# Altium schematic sheet 04_Sch.SchDoc
size A3
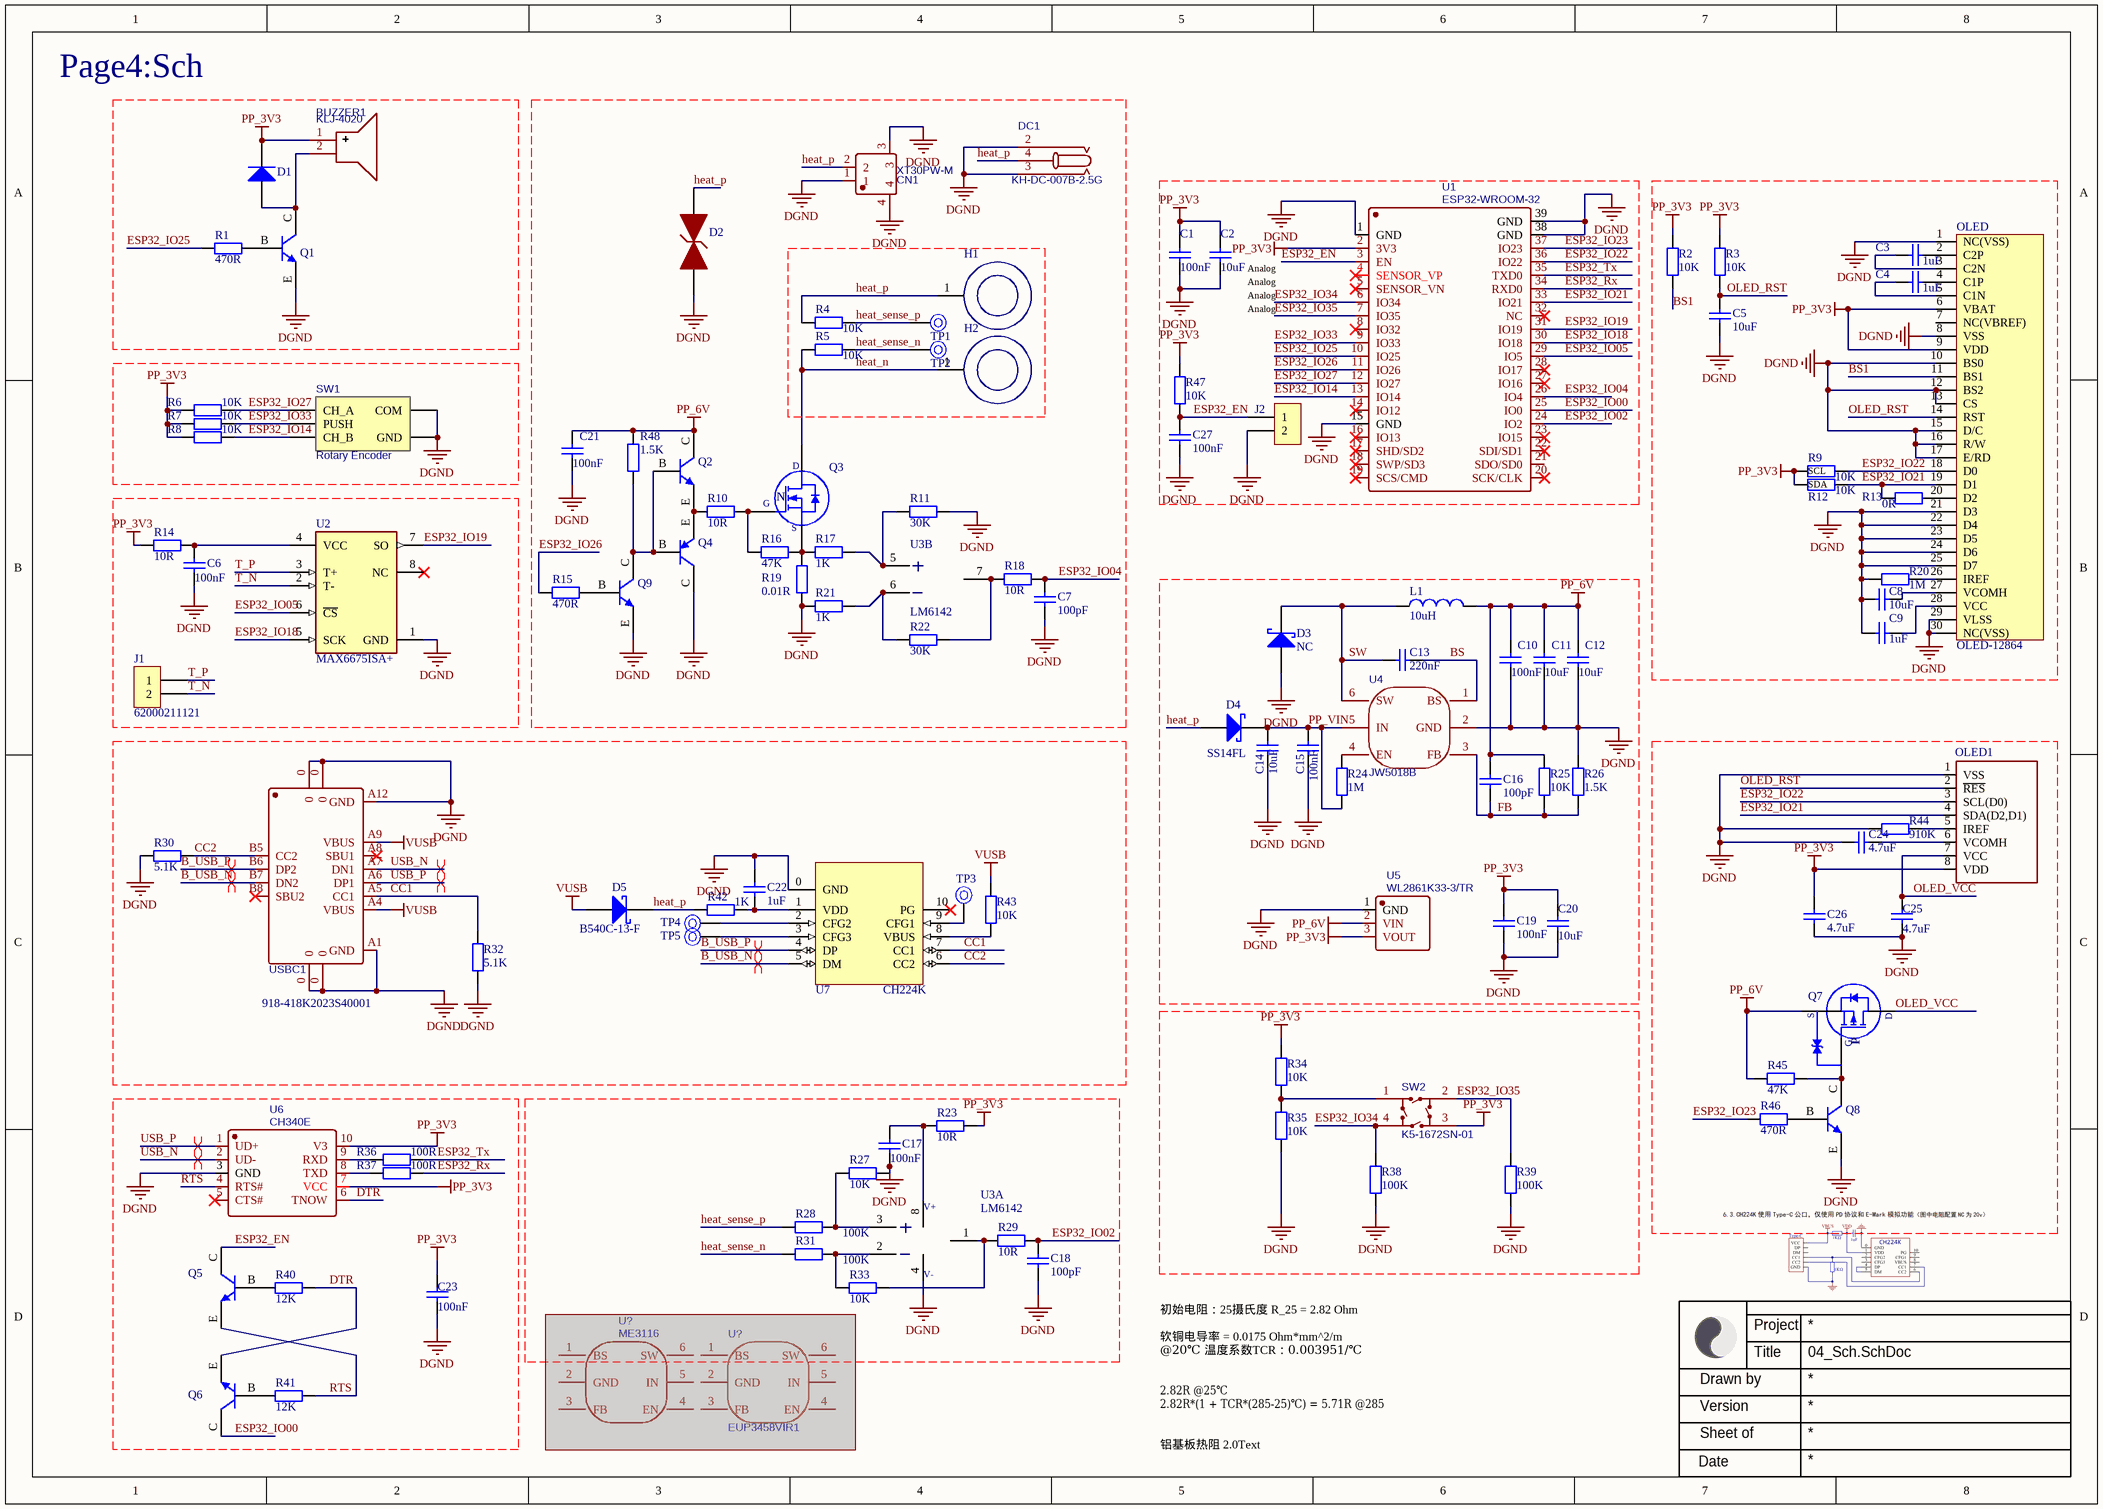
[diagram p0: 04_Sch.SchDoc]

## Parts
(Parts that share a designator on the sheet are numbered #1, #2 ... from top to bottom, then left to right.)
BUZZER1  KLJ-4020  [BUZ-SMD_L4.0-W4.0-P3.50-L]
C1  100nF  [C0603]
C2  10uF  [C0805]
C3  1uF  [C0603]
C4  1uF  [C0603]
C5  10uF  [C0603]
C6  100nF  [C0603]
C7  100pF  [C0603]
C8  10uF  [C0603]
C9  1uF  [C0603]
C10  100nF  [C0603]
C11  10uF  [C1210]
C12  10uF  [C1210]
C13  220nF  [C0603]
C14  10uF  [C1210]
C15  100nF  [C0603]
C16  100pF  [C0603]
C17  100nF  [C0603]
C18  100pF  [C0603]
C19  100nF  [C0603]
C20  10uF  [C0805]
C21  100nF  [C0603]
C22  1uF  [C0603]
C23  100nF  [C0603]
C24  4.7uF  [C0603]
C25  4.7uF  [C0603]
C26  4.7uF  [C0603]
C27  100nF  [C0603]
CN1  XT30PW-M  [CONN-TH_XT30PW-M]
D1  1N4148WT-7  [SOD-523]  (value not drawn)
D2  SMBJ33CA  [SMBJ-CA_MFG]  (value not drawn)
D3  NC  [SOD-123FL]
D4  SS14FL  [SOD-123FL]
D5  B540C-13-F  [SMC]
DC1  KH-DC-007B-2.5G  [DC-IN-TH_KH-DC-007B-2.1G]
H1  (no value)  [THC3R5D1R6-M1R6-PTH]
H2  (no value)  [THC3R5D1R6-M1R6-PTH]
J1  62000211121  [CON2P-2R0-TH]
J2  62000211121  [CON2P-2R0-TH]  (value not drawn)
L1  10uH  [IND4R45X4R06X1-2]
OLED  OLED-12864  [OLED-12864-1.3-TOP]
OLED1  OLED12864_8Pin  [OLED_0.69_8Pin]  (value not drawn)
Q1  MMBT2222ALT1G  [SOT-23-BCE]  (value not drawn)
Q2  MMBT2222ALT1G  [SOT-23-BCE]  (value not drawn)
Q3  (no value)  [D2PAK-3-GDS]
Q4  MMBT4403  [SOT-23-BCE]  (value not drawn)
Q5  MMBT2222ALT1G  [SOT-23-BCE]  (value not drawn)
Q6  MMBT2222ALT1G  [SOT-23-BCE]  (value not drawn)
Q7  CPH3355-TL-W  [SOT-23-GDS]  (value not drawn)
Q8  MMBT2222ALT1G  [SOT-23-BCE]  (value not drawn)
Q9  MMBT2222ALT1G  [SOT-23-BCE]  (value not drawn)
R1  470R  [R0603]
R2  10K  [R0603]
R3  10K  [R0603]
R4  10K  [R0603]
R5  10K  [R0603]
R6  10K  [R0603]
R7  10K  [R0603]
R8  10K  [R0603]
R9  10K  [R0603]
R10  10R  [R0603]
R11  30K  [R0603]
R12  10K  [R0603]
R13  0R  [R0603]
R14  10R  [R0603]
R15  470R  [R0603]
R16  47K  [R0603]
R17  1K  [R0603]
R18  10R  [R0603]
R19  0.01R  [R2512]
R20  1M  [R0603]
R21  1K  [R0603]
R22  30K  [R0603]
R23  10R  [R0603]
R24  1M  [R0603]
R25  10K  [R0603]
R26  1.5K  [R0603]
R27  10K  [R0603]
R28  100K  [R0603]
R29  10R  [R0603]
R30  5.1K  [R0603]
R31  100K  [R0603]
R32  5.1K  [R0603]
R33  10K  [R0603]
R34  10K  [R0603]
R35  10K  [R0603]
R36  100R  [R0603]
R37  100R  [R0603]
R38  100K  [R0603]
R39  100K  [R0603]
R40  12K  [R0603]
R41  12K  [R0603]
R42  1K  [R0603]
R43  10K  [R0603]
R44  910K  [R0603]
R45  47K  [R0603]
R46  470R  [R0603]
R47  10K  [R0603]
R48  1.5K  [R0603]
SW1  Rotary Encoder  [SIQ-02FVS3]
SW2  K5-1672SN-01  [SW-SMD_K5-1672SN-01]
TP1  5001  [TP-2R54-TH]  (value not drawn)
TP2  5001  [TP-2R54-TH]  (value not drawn)
TP3  (no value)  [TP-0R5-SM]
TP4  (no value)  [TP-0R5-SM]
TP5  (no value)  [TP-0R5-SM]
U1  ESP32-WROOM-32  [WIFIM-SMD_ESP-32S]
U2  Part Number: MAX6675ISA+  [SOIC8-1R27-5X4]  (hidden comment: MAX6675ISA)
U3  LM6142  [SOIC8-1R27-5X4]  (parts A,B of 2)
U4  JW5018B  [SOT-23-6_L2.9-W1.6-P0.95-LS2.8-BR]
U5  WL2861K33-3/TR  [SOT-89-3_L4.5-W2.5-P1.50-LS4.2-BR]
U6  CH340E  [MSOP-10_L3.0-W3.0-P0.50-LS5.0-BL]
U7  CH224K  [ESSOP10]
U?#1  ME3116  [SOT-23-6_L2.9-W1.6-P0.95-LS2.8-BR]  (masked out: inside a compile mask, not in the netlist)
U?#2  EUP3458VIR1  [SOT-23-6_L2.9-W1.6-P0.95-LS2.8-BR]  (masked out: inside a compile mask, not in the netlist)
USBC1  value 918-418K2023S40001  [USB-C-SMD_TYPE-C-USB-17]  (hidden comment: USB3.1C16PFSMT)

## Nets
DGND: C1.2 C2.2 C5.1 C6.2 C7.2 C8.1 C9.1 C10.2 C11.2 C12.2 C14.2 C15.2 C17.2 C18.2 C19.2 C20.2 C21.2 C22.2 C23.2 C24.1 C25.1 C26.1 C27.2 CN1.1 CN1.3 CN1.4 D2.1 D3.1 DC1.2 DC1.3 J2.2 OLED.1(NC(VSS)) OLED.8(VSS) OLED.10(BS0) OLED.12(BS2) OLED.13(CS) OLED.15(D/C) OLED.16(R/W) OLED.17(E/RD) OLED.21(D3) OLED.22(D4) OLED.23(D5) OLED.24(D6) OLED.25(D7) OLED.29(VLSS) OLED.30(NC(VSS)) OLED1.1(VSS) Q1.E Q4.C Q8.E Q9.E R11.2 R19.1 R20.1 R21.1 R26.2 R27.2 R30.2 R32.1 R35.1 R38.1 R39.1 R44.1 SW1.3(COM) SW1.5(GND) U1.1(GND) U1.15(GND) U1.38(GND) U1.39(GND) U2.1(GND) U3.4(V-) U4.2(GND) U5.1(GND) U6.3(GND) U7.0(GND) USBC1.0 USBC1.A1(GND) USBC1.A12(GND)
PP_3V3: BUZZER1.1(+) C1.1 C2.1 C19.1 C20.1 C23.1 C26.2 D1.2 OLED.6(VBAT) OLED.9(VDD) OLED1.8(VDD) R2.1 R3.2 R6.1 R7.1 R8.1 R9.1 R12.1 R14.1 R23.1 R34.2 R47.1 SW2.3 U1.2(3V3) U5.3(VOUT) U6.7(VCC) U6.10(V3)
PP_6V: C10.1 C11.1 C12.1 C16.1 C21.1 L1.1 Q2.C Q7.S R25.2 R45.1 R48.2 U5.2(VIN)
VUSB: D5.1 R43.2 USBC1.A4(VBUS) USBC1.A9(VBUS)
B_USB_N: U7.5(DM) USBC1.B7(DN2)
B_USB_P: U7.4(DP) USBC1.B6(DP2)
BS: C13.1 U4.1(BS)
BS1: OLED.11(BS1) R2.2
CC1: R32.2 U7.7(CC1) USBC1.A5(CC1)
CC2: R30.1 U7.6(CC2) USBC1.B5(CC2)
DTR: Q6.E R40.2 U6.6(TNOW)
ESP32_EN: C27.1 J2.1 Q5.C R47.2 U1.3(EN)
ESP32_IO00: Q6.C U1.25(IO0)
ESP32_IO02: C18.1 R29.2 U1.24(IO2)
ESP32_IO04: C7.1 R18.2 U1.26(IO4)
ESP32_IO05: U1.29(IO5) U2.6(~{CS})
ESP32_IO14: R8.2 SW1.4(CH_B) U1.13(IO14)
ESP32_IO18: U1.30(IO18) U2.5(SCK)
ESP32_IO19: U1.31(IO19) U2.7(SO)
ESP32_IO21: OLED.19(D1) OLED1.4(SDA(D2,D1)) R12.2 R13.1 U1.33(IO21)
ESP32_IO22: OLED.18(D0) OLED1.3(SCL(D0)) R9.2 U1.36(IO22)
ESP32_IO23: R46.1 U1.37(IO23)
ESP32_IO25: R1.1 U1.10(IO25)
ESP32_IO26: R15.1 U1.11(IO26)
ESP32_IO27: R6.2 SW1.1(CH_A) U1.12(IO27)
ESP32_IO33: R7.2 SW1.2(PUSH) U1.9(IO33)
ESP32_IO34: R38.2 SW2.4 U1.6(IO34)
ESP32_IO35: R39.2 SW2.2 U1.7(IO35)
ESP32_Rx: R37.2 U1.34(RXD0)
ESP32_Tx: R36.2 U1.35(TXD0)
FB: C16.2 R25.1 R26.1 U4.3(FB)
heat_n: H2.1 Q3.D R5.1
heat_p: CN1.2 D2.2 D4.1 D5.2 DC1.4 H1.1 R4.1 R42.1
heat_sense_n: R5.2 R31.1 TP2.1
heat_sense_p: R4.2 R28.1 TP1.1
OLED_RST: C5.2 OLED.14(RST) OLED1.2(~{RES}) R3.1
OLED_VCC: C25.2 OLED1.7(VCC) Q7.D
PP_VIN: C14.1 C15.1 D4.2 R24.1 U4.5(IN)
RTS: Q5.E R41.2 U6.4(RTS#)
SW: C13.2 D3.2 L1.2 U4.6(SW)
T_N: J1.2 U2.2(T-)
T_P: J1.1 U2.3(T+)
USB_N: U6.2(UD-) USBC1.A7(DN1)
USB_P: U6.1(UD+) USBC1.A6(DP1)
NetBUZZER1_2: BUZZER1.2(-) D1.1 Q1.C
NetC3_1: C3.1 OLED.3(C2N)
NetC3_2: C3.2 OLED.2(C2P)
NetC4_1: C4.1 OLED.5(C1N)
NetC4_2: C4.2 OLED.4(C1P)
NetC6_1: C6.1 R14.2 U2.4(VCC)
NetC8_2: C8.2 OLED.27(VCOMH)
NetC9_2: C9.2 OLED.28(VCC)
NetC17_1: C17.1 R23.2 U3.8(V+)
NetC22_1: C22.1 R42.2 U7.1(VDD)
NetC24_2: C24.2 OLED1.6(VCOMH)
NetOLED1_5: OLED1.5(IREF) R44.2
NetOLED_20: OLED.20(D2) R13.2
NetOLED_26: OLED.26(IREF) R20.2
NetQ1_B: Q1.B R1.2
NetQ2_B: Q2.B Q4.B Q9.C R48.1
NetQ2_E: Q2.E Q4.E R10.1
NetQ3_G: Q3.G R10.2 R16.1
NetQ3_S: Q3.S R16.2 R17.1 R19.2
NetQ5_B: Q5.B R40.1
NetQ6_B: Q6.B R41.1
NetQ7_G: Q7.G Q8.C R45.2
NetQ8_B: Q8.B R46.2
NetQ9_B: Q9.B R15.2
NetR11_1: R11.1 R17.2 U3.5(+INB)
NetR18_1: R18.1 R22.2 U3.7(OUT_B)
NetR21_2: R21.2 R22.1 U3.6(-IN_B)
NetR24_2: R24.2 U4.4(EN)
NetR27_1: R27.1 R28.2 U3.3(+IN_A)
NetR29_1: R29.1 R33.2 U3.1(OUT_A)
NetR31_2: R31.2 R33.1 U3.2(-IN_A)
NetR34_1: R34.1 R35.2 SW2.1
NetR36_1: R36.1 U6.9(RXD)
NetR37_1: R37.1 U6.8(TXD)
NetR43_1: R43.1 U7.8(VBUS)
NetTP3_1: TP3.1 U7.9(CFG1)
NetTP4_1: TP4.1 U7.2(CFG2)
NetTP5_1: TP5.1 U7.3(CFG3)

Not connected (* = marked no-connect by the designer): OLED 7(NC(VBREF)); U1 4(SENSOR_VP)* 5(SENSOR_VN)* 8(IO32)* 14(IO12)* 16(IO13)* 17(SHD/SD2)* 18(SWP/SD3)* 19(SCS/CMD)* 20(SCK/CLK)* 21(SDO/SD0) 22(SDI/SD1)* 23(IO15)* 27(IO16)* 28(IO17)* 32(NC)*; U2 8(NC)*; U6 5(CTS#)*; U7 10(PG)*; USBC1 A8(SBU1)* B8(SBU2)*

## Layout directives
differential pair: B_USB_N, B_USB_P, USB_N, USB_P

## Notes on the sheet
- Page4:Sch
- (near C2) Analog
- Analog
- (near R12) SDA
- (near R9) SCL
- 初始电阻：25摄氏度 R_25 = 2.82 Ohm
  软铜电导率 = 0.0175 Ohm*mm^2/m @20℃ 温度系数TCR：0.003951/℃
  2.82R @25℃
  2.82R*(1 + TCR*(285-25)℃) = 5.71R @285
  铝基板热阻 2.0Text
- Drawn by
- Project
- Title
- Version
- Sheet of
- Date
- (in symbol 101MN-00036AM.01) N

## Library data of the parts
BUZZER1 = KLJ-4020: BOM_Manufacturer: KELIKING; Contributor: LCSC; Frequency: 4kHz; BOM_Supplier: LCSC; BOM_Supplier Part: C556936; BOM_Manufacturer Part: KLJ-4020; BOM_JLCPCB Part Class: Extended Part; spicePre: B; spiceSymbolName: KLJ-4020
C1 C6 C10 C15 C17 C19 C21 C23 C27 = 101CC-00003IA.01: SMD,电容量100nF,额定电压50V,偏差±10%,材质X7R,0603; Allow Altenative Part: Y; serial number: 194; Categories: 电容; Tolerance: ±10%; Rated Voltage: 50V; Temperature Coefficient: X7R; COMPONENTLINK 1 DESCRIPTION: OpenDatasheet; Modify time: 2018年10月27号; Preferred: P; Part Number: 101CC-00003IA.01; Category: 贴片电容; Value: 100nF; PACKAGE: Tape&Reel; Mounting Type: SurfaceMount; Size: 0603; Supplier 1: 运泰利; Supplier Part Number 1: 100nF,0603,50V
C2 C20 = 101CC-00453BW.01: SMD,电容量10uF,额定电压10V,偏差±10%,材质X7R,0805; Allow Altenative Part: Y; serial number: 52; Categories: 电容; Tolerance: ±10%; Rated Voltage: 10V; Temperature Coefficient: X7R; COMPONENTLINK 1 DESCRIPTION: GetDatasheet; Remark: Verified by BU1（黄雄青） check list V1.0; Modify time: 2016年05月12号; Approved: YES; Part Number: 101CC-00453BW.01; Category: 贴片电容; Value: 10uF; PACKAGE: Tape&Reel; Mounting Type: SurfaceMount; Size: 0805; Supplier 1: YAGEO; Supplier Part Number 1: CC0805KKX7R6BB106; Pricing 1: 0.423; COMPONENTLINK 1 URL: http://www.yageo.com/documents/recent/UPY-GPHC_X7R_6.3V-to-50V_13.pdf; MOQ: 3000
C3 C4 C9 C22 = 101CC-00005IA.01: SMD,电容量1uF,额定电压50V,偏差±10%,材质X5R,0603; Allow Altenative Part: Y; serial number: 196; Categories: 电容; Tolerance: ±10%; Rated Voltage: 50V; Temperature Coefficient: X5R; COMPONENTLINK 1 DESCRIPTION: OpenDatasheet; Modify time: 2018年10月27号; Preferred: P; Part Number: 101CC-00005IA.01; Category: 贴片电容; Value: 1uF; PACKAGE: Tape&Reel; Mounting Type: SurfaceMount; Size: 0603; Supplier 1: 运泰利; Supplier Part Number 1: 1uF,0603,50V
C5 C8 = 101CC-00006IA.01: SMD,电容量10uF,额定电压25V,偏差±20%,材质X5R,0603; Allow Altenative Part: Y; serial number: 197; Categories: 电容; Tolerance: ±20%; Rated Voltage: 25V; Temperature Coefficient: X5R; COMPONENTLINK 1 DESCRIPTION: OpenDatasheet; Modify time: 2018年10月27号; Preferred: P; Part Number: 101CC-00006IA.01; Category: 贴片电容; Value: 10uF; PACKAGE: Tape&Reel; Mounting Type: SurfaceMount; Size: 0603; Supplier 1: 运泰利; Supplier Part Number 1: 10uF,0603,25V
C7 C16 C18 = 101CC-00004IA.01: SMD,电容量100pF,额定电压50V,偏差±5%,材质NP0,0603; Allow Altenative Part: Y; serial number: 195; Categories: 电容; Tolerance: ±5%; Rated Voltage: 50V; Temperature Coefficient: NP0; COMPONENTLINK 1 DESCRIPTION: OpenDatasheet; Modify time: 2018年10月27号; Preferred: P; Part Number: 101CC-00004IA.01; Category: 贴片电容; Value: 100pF; PACKAGE: Tape&Reel; Mounting Type: SurfaceMount; Size: 0603; Supplier 1: 运泰利; Supplier Part Number 1: 100pF,0603,50V
C11 C12 C14 = 101CC-00555BW.01: SMD,电容量10uF,额定电压50V,偏差±10%,材质X7R,1210; Allow Altenative Part: Y; serial number: 176; Categories: 电容; Tolerance: ±10%; Rated Voltage: 50V; Temperature Coefficient: X7R; COMPONENTLINK 1 DESCRIPTION: OpenDatasheet; Modify time: 2018年5月26号; Part Number: 101CC-00555BW.01; Category: 贴片电容; Value: 10uF; PACKAGE: Tape&Reel; Mounting Type: SurfaceMount; Size: 1210; Supplier 1: YAGEO; Supplier Part Number 1: CC1210KKX7R9BB106; COMPONENTLINK 1 URL: http://www.yageo.com/documents/recent/UPY-GPHC_X7R_6.3V-to-50V_18.pdf
C13 = 101CC-00490BW.01: SMD,电容量220nF,额定电压50V,精度±10%,材质X7R,0603; Allow Altenative Part: Y; serial number: 80; Categories: 电容; Tolerance: ±10%; Rated Voltage: 50V; Temperature Coefficient: X7R; COMPONENTLINK 1 DESCRIPTION: GetDatasheet; Remark: Verified by BU1（黄雄青） check list V1.0; Modify time: 2017年01月07号; Approved: YES; Part Number: 101CC-00490BW.01; Category: 贴片电容; Value: 220nF; PACKAGE: Tape&Reel; Mounting Type: SurfaceMount; Size: 0603; Supplier 1: YAGEO; Supplier Part Number 1: CC0603KRX7R9BB224
C24-C26 = 101CC-00390AV.01: 安装方式SMD,电容量4.7uF,额定电压25V,偏差±10%,材质X5R,0603; Allow Altenative Part: Y; serial number: 587; Categories: 电容; Tolerance: ±10%; Rated Voltage: 25V; Temperature Coefficient: X5R; COMPONENTLINK 1 DESCRIPTION: GetDatasheet; Modify time: 2019年9月14号; Part Number: 101CC-00390AV.01; Category: 贴片电容; Value: 4.7uF; PACKAGE: Tape&Reel; Mounting Type: SurfaceMount; Size: 0603; Supplier 1: Murata; Supplier Part Number 1: GRM188R61E475KE11D; COMPONENTLINK 1 URL: https://www.murata.com/~/media/webrenewal/support/library/catalog/products/capacitor/mlcc/c02e.ashx?la=en-us
CN1 = XT30PW-M: BOM_Manufacturer: Changzhou Amass Elec; Contributor: LCSC; BOM_Supplier: LCSC; BOM_Supplier Part: C431092; BOM_Manufacturer Part: XT30PW-M; BOM_JLCPCB Part Class: Extended Part; spicePre: C; spiceSymbolName: XT30PW-M
D1 = 101DG-00019AF.01: SMD,SOD-523（0603）,额定电压80V,电流125mA; Allow Altenative Part: Y; serial number: 48; Categories: 二极管; Rated Voltage: 80V; Rated Current: 250mA; COMPONENTLINK 1 DESCRIPTION: GetDatasheet; Remark: Verified by CRD（张宗良） check list V1.0; Modify time: 2015年07月28号; Approved: YES; Preferred: P; Part Number: 101DG-00019AF.01; Category: 普通二极管; Value: 1N4148WT-7; PACKAGE: Tape&Reel; Mounting Type: SurfaceMount; Supplier 1: DIODES; Supplier Part Number 1: 1N4148WT-7; Pricing 1: 0.36; COMPONENTLINK 1 URL: http://www.diodes.com/datasheets/ds30396.pdf; MOQ: 1000
D2 = SMBJ28CA
D3 D4 = 101DS-00017AI.01: SMD,封装外壳SOD-123-2,额定电压40V,电流1A; Allow Altenative Part: Y; serial number: 98; Categories: 二极管; Rated Voltage: 40V; Rated Current: 1A; COMPONENTLINK 1 DESCRIPTION: GetDatasheet; Remark: Verified by CRD（李思奇） check list V3.0; Modify time: 2017年03月20号; Approved: YES; Part Number: 101DS-00017AI.01; Category: 肖特基二极管; PACKAGE: Tape&Reel; Mounting Type: SurfaceMount; Supplier 1: Fairchild; Pricing 1: 1.28; COMPONENTLINK 1 URL: https://www.fairchildsemi.com/datasheets/SS/SS13FL.pdf
  D3: Value: NC; Supplier Part Number 1: NC
  D4: Value: SS14FL; Supplier Part Number 1: SS14FL
D5 = 101DS-00045AF.01: SMD,封装外壳SMC（DO-214AB）,额定电压40V,电流5A; Allow Altenative Part: Y; serial number: 86; Categories: 二极管; Rated Voltage: 40V; Rated Current: 5A; COMPONENTLINK 1 DESCRIPTION: GetDatasheet; Remark: Verified by CRD（张宗良） check list V1.0; Modify time: 2017年01月23号; Approved: YES; Preferred: P; Part Number: 101DS-00045AF.01; Category: 肖特基二极管; Value: B540C-13-F; PACKAGE: Tape&Reel; Mounting Type: SurfaceMount; Supplier 1: DIODES; Supplier Part Number 1: B540C-13-F; Pricing 1: 1.4; COMPONENTLINK 1 URL: https://www.diodes.com/assets/Datasheets/ds13012.pdf; MOQ: 3000
DC1 = KH-DC-007B-2.5G: BOM_Manufacturer: kinghelm(金航标); Contributor: LCSC; BOM_Supplier: LCSC; BOM_Supplier Part: C2847176; BOM_Manufacturer Part: KH-DC-007B-2.5G; BOM_JLCPCB Part Class: Extended Part; spicePre: D; spiceSymbolName: KH-DC-007B-2.5G
H1 H2 = M1.6-PTH: Allow Altenative Part: Y; serial number: 9; Categories: 符号; Modify time: 2017年2月13日; Approved: YES; Part Number: M1.6-PTH; Category: SCREW; Supplier 1: CRD
J1 J2 = 102NL-00015BV.01: DIP,封装脚距2mm,180度,1x2PIN,黑色; Allow Altenative Part: Y; serial number: 70; Categories: 连接器; COMPONENTLINK 1 DESCRIPTION: GetDatasheet; Remark: Verified by CRD（赖程奇） check list V1.0; Modify time: 2015年07月10号; Approved: YES; Part Number: 102NL-00015BV.01; Category: 单排针; Value: 62000211121; PACKAGE: Bulk; Mounting Type: ThroughHole; Supplier 1: wurth; Supplier Part Number 1: 62000211121; Pricing 1: 0.98; COMPONENTLINK 1 URL: http://katalog.we-online.de/en/em/620_0xx_111_21/620_032_111_21?m=n&sp=http%3A%2F%2Fwww.we-online.com%2Fweb%2Fen%2Fwuerth_elektronik%2Fsearchpage.php%3Fsearch%3D62003211121; MOQ: 500
L1 = 101LP-00508BV.01: 安装方式SMD,电感值10uH,精度±20%,额定电流1.5A,屏蔽式,4.45x4.06x1.8mm; Allow Altenative Part: Y; serial number: 194; Categories: 电感; Tolerance: ±20%; Rated Current: 1.5A; COMPONENTLINK 1 DESCRIPTION: OpenDatasheet; Modify time: 2019年8月10号; Part Number: 101LP-00508BV.01; Category: 功率电感; Value: 10uH; PACKAGE: Tape&Reel; Mounting Type: SurfaceMount; Size: 4.45x4.06x1.8mm; Supplier 1: Wurth; Supplier Part Number 1: 74437324100; COMPONENTLINK 1 URL: https://katalog.we-online.com/pbs/datasheet/74437324100.pdf
OLED = OLED-12864: 显示屏
Q1 Q2 Q5 Q6 Q8 Q9 = 101GN-00006BA.01: SMD,封装形式SOT-23,耐压值40V,额定电流600mA,耗散功率225mW; Allow Altenative Part: Y; serial number: 10; Categories: 三极管; Rated Power: 225mW; Rated Voltage: 40V; Rated Current: 600mA; COMPONENTLINK 1 DESCRIPTION: OpenDatasheet; Remark: Verified by BU1（吴明徽）check list V1.0; Modify time: 2017年01月07号; Approved: YES; Preferred: P; Part Number: 101GN-00006BA.01; Category: NPN三极管; Value: MMBT2222ALT1G; PACKAGE: Tape&Reel; Mounting Type: SurfaceMount; Size: SOT-23; Supplier 1: ON; Supplier Part Number 1: MMBT2222ALT1G
Q3 = 101MN-00036AM.01: SMD,封装方式TO263-3,额定电压60V,耗散功率110W,Vgs ±20V,额定电流79A; Allow Altenative Part: Y; serial number: 42; Categories: MOS管; Rated Power: 110W; Rated Voltage: 60V; Rated Current: 79A; Other: Vgs:±20V; COMPONENTLINK 1 DESCRIPTION: OpenDatasheet; Remark: Verified by CRD（陈佳莺） check list V5.0; Modify time: 2017年06月12号; Approved: YES; Preferred: P; Part Number: 101MN-00036AM.01; Category: N型MOS管; PACKAGE: Tape&Reel; Mounting Type: SurfaceMount; Size: TO263-3; Supplier 1: Infineon; COMPONENTLINK 1 URL: http://www.infineon.com/dgdl/irf1018epbf.pdf?fileId=5546d462533600a4015355da854e1891
Q4 = 101GP-00002DC.01: SMD,封装形式SOT-23,耐压值40V,额定电流600mA,耗散功率300W; Allow Altenative Part: Y; serial number: 5; Categories: 三极管; Rated Power: 300mW; Rated Voltage: 40V; Rated Current: 600mA; COMPONENTLINK 1 DESCRIPTION: OpenDatasheet; Remark: Verified by BU1（吴明徽）check list V1.0; Modify time: 2016年05月12号; Approved: YES; Preferred: P; Part Number: 101GP-00002DC.01; Category: PNP三极管; Value: MMBT4403; PACKAGE: Tape&Reel; Mounting Type: SurfaceMount; Size: SOT-23; Supplier 1: 长电科技; Supplier Part Number 1: MMBT4403; Pricing 1: 0.27; COMPONENTLINK 1 URL: http://www.cj-elec.com/gallery/txUpfile/b230a503159d7ae6350c54e4b05a58ed.pdf; MOQ: 3000
Q7 = 101MP-00024BA.01: 安装方式SMD,封装方式SOT-23,额定电压-30V,耗散功率1.0W,Vgs-2.6V,额定电流-2.5A; Allow Altenative Part: Y; serial number: 76; Categories: MOS管; Rated Power: 1.0W; Rated Voltage: -30V; Rated Current: -2.5A; COMPONENTLINK 1 DESCRIPTION: OpenDatasheet; Modify time: 2018年11月24号; Preferred: P; Part Number: 101MP-00024BA.01; Category: P型MOS管; Value: CPH3355-TL-W; Other: Vgs-2.6V; PACKAGE: Tape&Reel; Mounting Type: SurfaceMount; Supplier 1: ON; Supplier Part Number 1: CPH3355-TL-W; COMPONENTLINK 1 URL: http://www.mouser.cn/datasheet/2/308/CPH3355-D-918319.pdf
R1 R15 R46 = 101RC-00049IA.01: SMD,阻值470R,精度±1%,0603,额定功率1/10W; Allow Altenative Part: Y; serial number: 464; Categories: 电阻; Tolerance: ±1%; Rated Power: 1/10W; COMPONENTLINK 1 DESCRIPTION: OpenDatasheet; Modify time: 2018年10月29号; Preferred: P; Part Number: 101RC-00049IA.01; Category: 贴片电阻; Value: 470R; PACKAGE: Tape&Reel; Mounting Type: SurfaceMount; Size: 0603; Supplier 1: 运泰利; Supplier Part Number 1: 470R,0603,±1%
R2-R9 R12 R27 R33-R35 R47 = 101RC-01697BW.01: SMD,阻值10K,精度±0.1%,0603,额定功率1/10W; Allow Altenative Part: Y; serial number: 74; Categories: 电阻; Tolerance: ±0.1%; Rated Power: 1/10W; COMPONENTLINK 1 DESCRIPTION: OpenDatasheet; Remark: Verified by BU2（叶俊雄）& BU3（杨培）& CRD（赖程奇）check list V1.0; Modify time: 2016年2月17号; Approved: YES; Preferred: P; Part Number: 101RC-01697BW.01; Category: 贴片电阻; Value: 10K; PACKAGE: Tape&Reel; Mounting Type: SurfaceMount; Size: 0603; Supplier 1: YAGEO; Supplier Part Number 1: RT0603BRD0710KL; Pricing 1: 0.43559; COMPONENTLINK 1 URL: http://www.yageo.com/documents/recent/PYu-RT_1-to-0.05_RoHS_L_6.pdf; MOQ: 5000
R10 R14 R18 R23 R29 = 101RC-00016IA.01: SMD,阻值10R,精度±1%,0603,额定功率1/10W; Allow Altenative Part: Y; serial number: 451; Categories: 电阻; Tolerance: ±1%; Rated Power: 1/10W; COMPONENTLINK 1 DESCRIPTION: OpenDatasheet; Modify time: 2018年10月29号; Preferred: P; Part Number: 101RC-00016IA.01; Category: 贴片电阻; Value: 10R; PACKAGE: Tape&Reel; Mounting Type: SurfaceMount; Size: 0603; Supplier 1: 运泰利; Supplier Part Number 1: 10R,0603,±1%
R11 R22 = 101RC-01944BW.01: SMD,阻值30K,精度±1%,0603,额定功率1/10W; Allow Altenative Part: Y; serial number: 540; Categories: 电阻; Tolerance: ±1%; Rated Power: 1/10W; COMPONENTLINK 1 DESCRIPTION: OpenDatasheet; Modify time: 2016年10月28号; Part Number: 101RC-01944BW.01; Category: 贴片电阻; Value: 30K; PACKAGE: Tape&Reel; Mounting Type: SurfaceMount; Size: 0603; Supplier 1: YAGEO; Supplier Part Number 1: RC0603FR-0730KL; COMPONENTLINK 1 URL: http://www.yageo.com/documents/recent/PYu-RC_Group_51_RoHS_L_9.pdf
R13 = 101RC-00012IA.01: SMD,阻值0R,精度±1%,0603,额定功率1/10W; Allow Altenative Part: Y; serial number: 449; Categories: 电阻; Tolerance: ±1%; Rated Power: 1/10W; COMPONENTLINK 1 DESCRIPTION: OpenDatasheet; Modify time: 2018年10月29号; Preferred: P; Part Number: 101RC-00012IA.01; Category: 贴片电阻; Value: 0R; PACKAGE: Tape&Reel; Mounting Type: SurfaceMount; Size: 0603; Supplier 1: 运泰利; Supplier Part Number 1: 0R,0603,±1%
R16 R45 = 101RC-01892BW.01: SMD,阻值47K,精度±1%,0603,额定功率1/10W; Allow Altenative Part: Y; serial number: 132; Categories: 电阻; Tolerance: ±1%; Rated Power: 1/10W; COMPONENTLINK 1 DESCRIPTION: OpenDatasheet; Remark: Verified by BU3（吴明徽）check list V1.0; Modify time: 2016年08月22号; Approved: YES; Part Number: 101RC-01892BW.01; Category: 贴片电阻; Value: 47K; PACKAGE: Tape&Reel; Mounting Type: SurfaceMount; Size: 0603; Supplier 1: YAGEO; Supplier Part Number 1: RC0603FR-0747KL; Pricing 1: 0.014; COMPONENTLINK 1 URL: http://www.yageo.com/NewPortal/yageodocoutput?fileName=/pdf/R-Chip/PYu-RC_Group_51_RoHS_L_7.pdf; MOQ: 5000
R17 R21 R42 = 101RC-00002IA.01: SMD,阻值1K,精度±1%,0603,额定功率1/10W; Allow Altenative Part: Y; serial number: 441; Categories: 电阻; Tolerance: ±1%; Rated Power: 1/10W; COMPONENTLINK 1 DESCRIPTION: OpenDatasheet; Modify time: 2018年10月29号; Preferred: P; Part Number: 101RC-00002IA.01; Category: 贴片电阻; Value: 1K; PACKAGE: Tape&Reel; Mounting Type: SurfaceMount; Size: 0603; Supplier 1: 运泰利; Supplier Part Number 1: 1K,0603,±1%
R19 = 101RC-01223BS.01: 安装方式SMD,阻值0.01R,精度±1%,2512,额定功率1W,温漂系数±75 ppm/°C; Allow Altenative Part: Y; serial number: 310; Categories: 电阻; Tolerance: ±1%; Rated Power: 1W; COMPONENTLINK 1 DESCRIPTION: OpenDatasheet; Modify time: 2017年08月14号; Preferred: P; Part Number: 101RC-01223BS.01; Category: 贴片电阻; Value: 0.01R; PACKAGE: Tape&Reel; Mounting Type: SurfaceMount; Size: 2512; Supplier 1: Vishay; Supplier Part Number 1: WSLT2512R0100FEA; COMPONENTLINK 1 URL: http://www.vishay.com/docs/30121/wslt2512.pdf
R20 R24 = 101RC-00040IA.01: SMD,阻值1M,精度±1%,0603,额定功率1/10W; Allow Altenative Part: Y; serial number: 459; Categories: 电阻; Tolerance: ±1%; Rated Power: 1/10W; COMPONENTLINK 1 DESCRIPTION: OpenDatasheet; Modify time: 2018年10月29号; Preferred: P; Part Number: 101RC-00040IA.01; Category: 贴片电阻; Value: 1M; PACKAGE: Tape&Reel; Mounting Type: SurfaceMount; Size: 0603; Supplier 1: 运泰利; Supplier Part Number 1: 1M,0603,±1%
R25 R43 = 101RC-00003IA.01: SMD,阻值10K,精度±1%,0603,额定功率1/10W; Allow Altenative Part: Y; serial number: 442; Categories: 电阻; Tolerance: ±1%; Rated Power: 1/10W; COMPONENTLINK 1 DESCRIPTION: OpenDatasheet; Modify time: 2018年10月29号; Preferred: P; Part Number: 101RC-00003IA.01; Category: 贴片电阻; Value: 10K; PACKAGE: Tape&Reel; Mounting Type: SurfaceMount; Size: 0603; Supplier 1: 运泰利; Supplier Part Number 1: 10K,0603,±1%
R26 R48 = 101RC-01784BW.01: 安装方式SMD,阻值1.5K,精度±1%,0603,额定功率1/10W; Allow Altenative Part: Y; serial number: 701; Categories: 电阻; Tolerance: ±1%; Rated Power: 1/10W; COMPONENTLINK 1 DESCRIPTION: GetDatasheet; Modify time: 2019年4月13号; Part Number: 101RC-01784BW.01; Category: 贴片电阻; Value: 1.5K; PACKAGE: Tape&Reel; Mounting Type: SurfaceMount; Size: 0603; Supplier 1: YAGEO; Supplier Part Number 1: RC0603FR-071K5L; COMPONENTLINK 1 URL: http://www.yageo.com/documents/recent/PYu-RC_Group_51_RoHS_L_10.pdf
R28 R31 R38 R39 = 101RC-00323BW.01: SMD,阻值100K,精度±0.1%,0603,额定功率1/10W; Allow Altenative Part: Y; serial number: 17; Categories: 电阻; Tolerance: ±0.1%; Rated Power: 1/10W; COMPONENTLINK 1 DESCRIPTION: OpenDatasheet; Remark: Verified by BU2（叶俊雄） check list V1.0; Modify time: 2015年11月27号; Approved: YES; Preferred: P; Part Number: 101RC-00323BW.01; Category: 贴片电阻; Value: 100K; PACKAGE: Tape&Reel; Mounting Type: SurfaceMount; Size: 0603; Supplier 1: YAGEO; Supplier Part Number 1: RT0603BRD07100KL; Pricing 1: 0.43001; COMPONENTLINK 1 URL: http://www.yageo.com/documents/recent/PYu-RT_1-to-0.05_RoHS_L_6.pdf; MOQ: 5000
R30 R32 = 101RC-00378BW.01: SMD,阻值5.1K,精度±1%,0603,额定功率1/10W; Allow Altenative Part: Y; serial number: 35; Categories: 电阻; Tolerance: ±1%; Rated Power: 1/10W; COMPONENTLINK 1 DESCRIPTION: OpenDatasheet; Remark: Verified by BU3（吴明徽）check list V1.0; Modify time: 2015年11月27号; Approved: YES; Part Number: 101RC-00378BW.01; Category: 贴片电阻; Value: 5.1K; PACKAGE: Tape&Reel; Mounting Type: SurfaceMount; Size: 0603; Supplier 1: YAGEO; Supplier Part Number 1: RC0603FR-075K1L; Pricing 1: 0.01287; COMPONENTLINK 1 URL: http://www.yageo.com/exep/pages/download/literatures/PYu-R_Marking_2.pdf; MOQ: 5000
R36 R37 = 101RC-00017IA.01: SMD,阻值100R,精度±1%,0603,额定功率1/10W; Allow Altenative Part: Y; serial number: 452; Categories: 电阻; Tolerance: ±1%; Rated Power: 1/10W; COMPONENTLINK 1 DESCRIPTION: OpenDatasheet; Modify time: 2018年10月29号; Preferred: P; Part Number: 101RC-00017IA.01; Category: 贴片电阻; Value: 100R; PACKAGE: Tape&Reel; Mounting Type: SurfaceMount; Size: 0603; Supplier 1: 运泰利; Supplier Part Number 1: 100R,0603,±1%
R40 R41 = 101RC-00027BW.01: 安装方式SMD,阻值12K,精度±1%,0603,额定功率1/10W; Allow Altenative Part: Y; serial number: 538; Categories: 电阻; Tolerance: ±1%; Rated Power: 1/10W; COMPONENTLINK 1 DESCRIPTION: OpenDatasheet; Modify time: 2019年3月9号; Part Number: 101RC-00027BW.01; Category: 贴片电阻; Value: 12K; PACKAGE: Tape&Reel; Mounting Type: SurfaceMount; Size: 0603; Supplier 1: YAGEO; Supplier Part Number 1: RC0603FR-0712KL; COMPONENTLINK 1 URL: http://www.yageo.com/documents/recent/PYu-RC_Group_51_RoHS_L_9.pdf
R44 = R0603: Allow Altenative Part: Y; serial number: 750; Categories: 电阻; Remark: BU 需求; Modify time: 2017年03月06号; Approved: YES; Part Number: R0603; Category: 贴片电阻; PACKAGE: Tape&Reel; Mounting Type: SurfaceMount
SW1 = Rotary Encoder: SIQ-02FVS3; BOM_Manufacturer: ALPSALPINE; BOM_Manufacturer Part: EC11E1534443; Contributor: LCSC; BOM_Supplier: LCSC; BOM_Supplier Part: C1322543; BOM_JLCPCB Part Class: Extended Part; spicePre: S; spiceSymbolName: EC11E1534443
SW2 = K5-1672SN-01: BOM_Manufacturer: Korean Hroparts Elec; Contributor: LCSC; BOM_Supplier: LCSC; BOM_Supplier Part: C502360; BOM_Manufacturer Part: K5-1672SN-01; BOM_JLCPCB Part Class: Extended Part; spicePre: S; spiceSymbolName: K5-1672SN-01
TP1 TP2 = 102NJ-00012AU.01: 安装方式DIP，材质磷青铜镀银，塑高/针长3.05/3.05mm，耐压值无，黑色，直径2.54mmx4.57mm; Allow Altenative Part: Y; serial number: 851; Categories: 连接器; COMPONENTLINK 1 DESCRIPTION: GetDatasheet; Modify time: 2019年9月28号; Part Number: 102NJ-00012AU.01; Category: 测试点; Value: 5001; PACKAGE: Bulk; Mounting Type: ThroughHole; Supplier 1: Keystone; Supplier Part Number 1: 5001
TP3-TP5 = 0R5: SMD,直径0.5mm; Part Number: 0R5; Allow Altenative Part: Y; serial number: 796; Categories: 连接器; Modify time: 2019年6月8号; Category: 测试点; PACKAGE: Pipefittings; Mounting Type: SurfaceMount
U1 = ESP32-WROOM-32: BOM_Manufacturer: Espressif Systems; Contributor: LCSC; BOM_Supplier: LCSC; BOM_Supplier Part: C82899; BOM_Manufacturer Part: ESP32-WROOM-32; BOM_JLCPCB Part Class: Extended Part; spicePre: U; spiceSymbolName: ESP32-WROOM-32
U2 = MAX6675ISA: IC THERMOCOUP TO DGTL 8-SOIC; Manufacturer: Maxim Electronics; Category 9E07530Daf1645C0: Semiconductors and Actives; Category 3Cb8F1B20D37E77F: Sensors (Acceleration, Pressure, ...); Category 8A76477Cb9Bd51B1: Temperature Control and Regulation; Category 84F649Fcb0Ed5F31: Uncategorized; max_supply_voltage_dc: 5.50V; Category D46C1966E09E0Fab: Temperature; Category Db391633E8F300Fe: Industrial Control; Category C33B0E31F09B18Fc: Temperature Sensor ICs; Mfg Package Ident: 21-0041; Category E95E2454Daf93299: Temperature Sensing/Measurement; Category 2Fc5E2Cf1B85F402: Interface ICs; Category 6B95A69F5F75B052: Sensors and Accessories; Symbol 0 0: Standard; Num Pins: 8; supply_current: 0.70 mA; helpURL: https://upverter.com/upn/revision/df8f98e99e77f28c/; ComponentLink2Description: Datasheet; Temperature: -20°C to +85°C; Package: 21-0041; Supplier 2: Mouser; Supplier 1: Digi-Key; ComponentLink1URL: https://upverter.com/upn/revision/df8f98e99e77f28c/; Supplier Part Number 2: 700-MAX6675ISA; Supplier Part Number 1: MAX6675ISA+-ND; ComponentLink1Description: Upverter; ComponentLink2URL: https://upverter.com/datasheet/328f41e80cd5fba93d602566d8324382201f26da.pdf; RoHS: TRUE; Temperature Range High: +85°C; Octopart Part Number: 33bcfab92ad8ec7b; Digikey Description: IC THERMOCOUP TO DGTL 8-SOIC; Digikey Part Number: MAX6675ISA+-ND; Lead Free: yes; Type: integrated circuit; Category 20B3Edb914A9Fb74: Uncategorized; Mouser Part Number: 700-MAX6675ISA; Temperature Range Low: -20°C; Category 3B3Df6370Ab4E0Fa: Temperature Sensor ICs; Mounting Type: surface mount; Ipc Land Pattern Name: SOIC127P600X155-8
U3 = 101IF-00039BK.01: 安装方式SMD,SOIC-8,8PIN,运算放大器,; Allow Altenative Part: Y; serial number: 63; Categories: IC; COMPONENTLINK 1 DESCRIPTION: OpenDatasheet; Remark: Verified by BU2（叶俊雄） check list V1.0; Modify time: 2015年07月10号; Approved: YES; Part Number: 101IF-00039BK.01; Category: 运放IC; Value: LM6142; PACKAGE: Tape&Reel; Mounting Type: SurfaceMount; Supplier 1: TI; Supplier Part Number 1: LM6142; Pricing 1: 0.59; MOQ: 2500
U4 = JW5018B: 40V 600mA 800kHz Sync Buck; BOM_Manufacturer: JOULWATT; BOM_Supplier: LCSC; BOM_Manufacturer Part: JW5018B; BOM_JLCPCB Part Class: Extended Part; spiceSymbolName: JW5018B
U5 = WL2861K33-3/TR: BOM_Manufacturer: WILLSEMI(Will Semicon); Contributor: LCSC; BOM_Supplier: LCSC; BOM_Supplier Part: C910985; BOM_Manufacturer Part: WL2861K33-3/TR; BOM_JLCPCB Part Class: Extended Part; spicePre: U; spiceSymbolName: WL2861K33-3/TR
U6 = CH340E: BOM_Manufacturer: WCH; subpart_no: 1; BOM_Supplier: LCSC; BOM_Manufacturer Part: CH340E; BOM_Supplier Part: C99652; BOM_JLCPCB Part Class: Extended Part; spicePre: U; spiceSymbolName: CH340E
U7 = CH224K: USB PD & Type-C & Fast Charge Power Consumer Controller
U?#1 = ME3116: BOM_Manufacturer: MICRONE; BOM_Supplier: LCSC; BOM_Manufacturer Part: ME3116; BOM_Supplier Part: C97643; BOM_JLCPCB Part Class: Extended Part; spicePre: U; spiceSymbolName: ME3116
U?#2 = EUP3458VIR1: BOM_Manufacturer: EUTECH; BOM_Supplier: LCSC; BOM_Manufacturer Part: EUP3458VIR1; BOM_Supplier Part: C89300; BOM_JLCPCB Part Class: Extended Part; spicePre: U; spiceSymbolName: EUP3458VIR1
USBC1 = USB3.1C16PFSMT: BOM_Manufacturer: LCSC; BOM_Supplier: LCSC; BOM_Supplier Part: C167321; BOM_Manufacturer Part: -; Contributor: LCSC; BOM_JLCPCB Part Class: Extended Part; spicePre: U; spiceSymbolName: USB3.1C16PFSMT; Supplier Part Number 1: 918-418K2023S40001; Supplier 1: 精拓金